# Altium project Buck Converter.PrjPcb
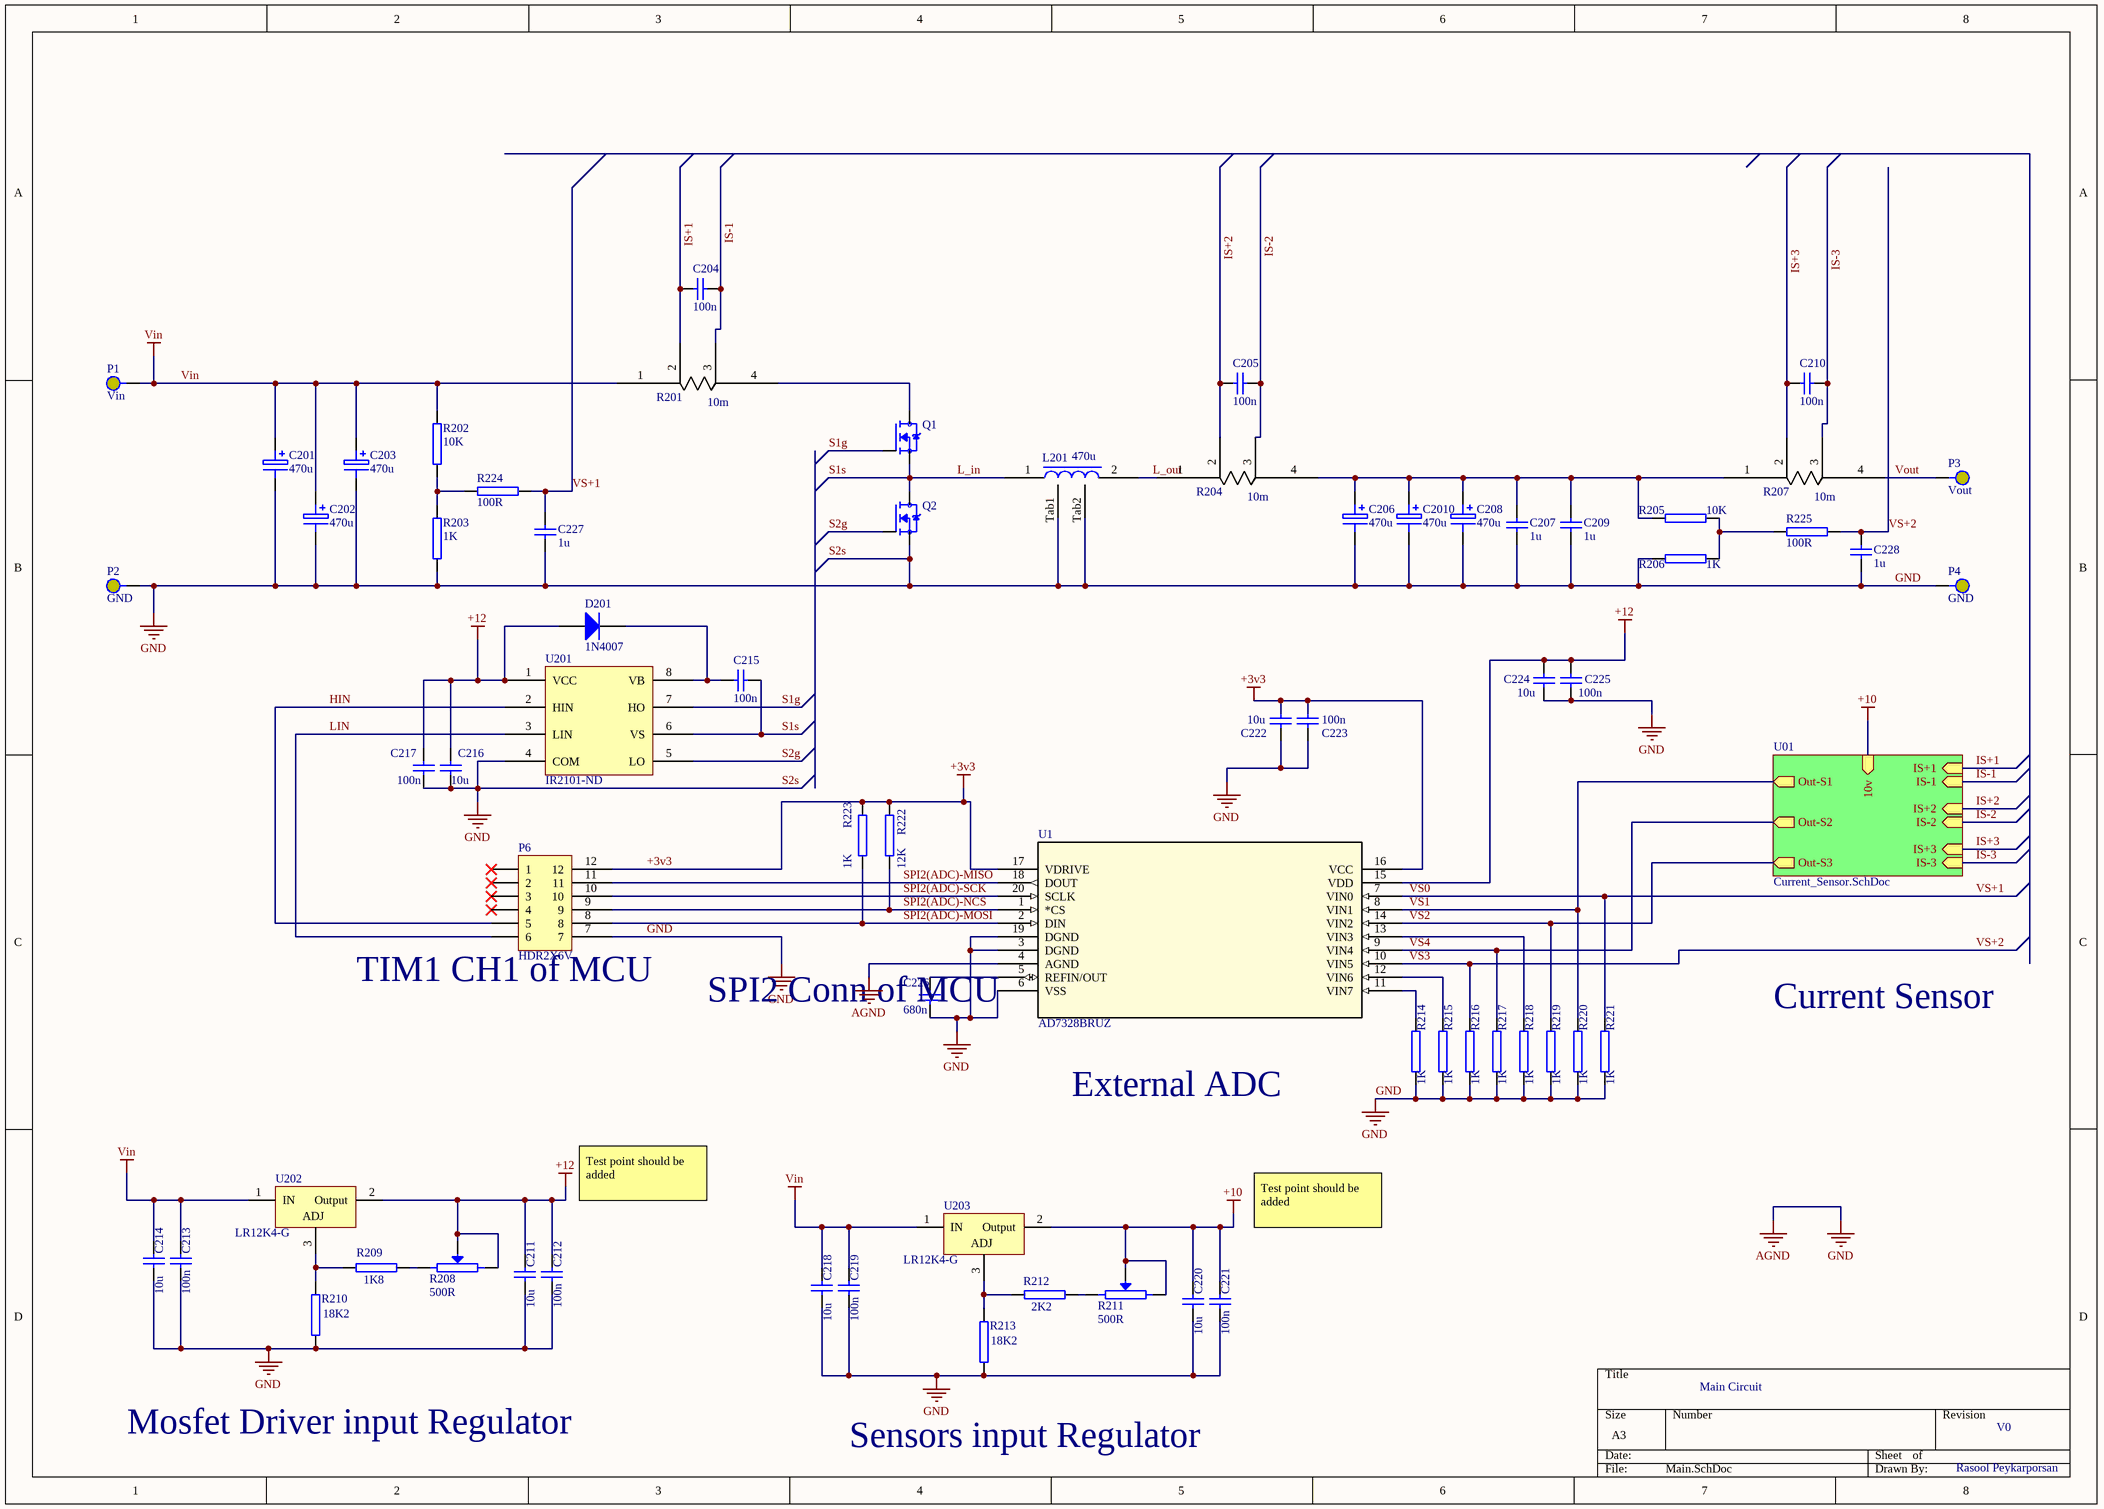
[diagram p0: Main.SchDoc]
2 sheets, 73 parts. Net scope: hierarchical (ports join the sheet entries above them; power ports are global).
Board file: PCB.PcbDoc
Sheets:
  Main.SchDoc
    U01 = Current_Sensor.SchDoc

## Sheet Main.SchDoc
size A3; SheetNumber: 1; SheetTotal: 2

### Parts
C201  470u  [CAPP200-400_AUT]
C202  470u  [CAPP200-400_AUT]
C203  470u  [CAPP200-400_AUT]
C204  100n  [CAP_1206]
C205  100n  [CAP_1206]
C206  470u  [CAPP200-400_AUT]
C207  1u  [RAD-0.2_AUT]
C208  470u  [CAPP200-400_AUT]
C209  1u  [RAD-0.2_AUT]
C210  100n  [CAP_1206]
C211  10u  [CAP_1206]
C212  100n  [CAP_1206]
C213  100n  [CAP_1206]
C214  10u  [CAP_1206]
C215  100n  [RAD-0.2_AUT]
C216  10u  [CAP_1206]
C217  100n  [CAP_1206]
C218  10u  [CAP_1206]
C219  100n  [CAP_1206]
C220  10u  [CAP_1206]
C221  100n  [CAP_1206]
C222  10u  [CAP_1206]
C223  100n  [CAP_1206]
C224  10u  [CAP_1206]
C225  100n  [CAP_1206]
C226  680n  [CAP_1206]
C227  1u  [CAP_1206]
C228  1u  [CAP_1206]
C2010  470u  [CAPP200-400_AUT]
D201  1N4007  [DIODE0.4_AUT]
L201  470u  [AGP4233_Hi]
P1  Vin  [Banana_AUT]
P2  GND  [Banana_AUT]
P3  Vout  [Banana_AUT]
P4  GND  [Banana_AUT]
P6  HDR2X6V  [HDR2X6V]
Q1  N-CHANNEL MOSFET,TOLL-8L  [TOLL-8L]  (value not drawn)
Q2  N-CHANNEL MOSFET,TOLL-8L  [TOLL-8L]  (value not drawn)
R201  10m  [WSL3673R_002-01]
R202  10K  [RES_1206]
R203  1K  [RES_1206]
R204  10m  [WSL3673R_002-01]
R205  10K  [RES_1206]
R206  1K  [RES_1206]
R207  10m  [WSL3673R_002-01]
R208  500R  [3296W]
R209  1K8  [RES_1206]
R210  18K2  [RES_1206]
R211  500R  [3296W]
R212  2K2  [RES_1206]
R213  18K2  [RES_1206]
R214  1K  [RES_1206]
R215  1K  [RES_1206]
R216  1K  [RES_1206]
R217  1K  [RES_1206]
R218  1K  [RES_1206]
R219  1K  [RES_1206]
R220  1K  [RES_1206]
R221  1K  [RES_1206]
R222  12K  [RES_1206]
R223  1K  [RES_1206]
R224  100R  [RES_1206]
R225  100R  [RES_1206]
U1  AD7328BRUZ  [TSSOP20_44]
U201  IR2101-ND  [DIP8-AUT]
U202  LR12K4-G  [D PAK (TO-252-3)]
U203  LR12K4-G  [D PAK (TO-252-3)]

### Sub-sheets
U01 = Current_Sensor.SchDoc: IS+1 (in), IS-1 (in), Out-S1 (out), IS+2 (in), IS-2 (in), Out-S2 (out), IS+3 (in), IS-3 (in), Out-S3 (out), 10v (in)

### Nets
+3v3: C222.2 C223.2 P6.12 R222.2 R223.2 U1.16(VCC) U1.17(VDRIVE)
+10: C220.2 C221.2 R211.2(BOT) R211.W(TAP) U203.2(Output) ; sheet U01/10v
+12: C211.2 C212.2 C216.2 C217.2 C224.2 C225.2 D201.A R208.2(BOT) R208.W(TAP) U1.15(VDD) U201.1(VCC) U202.2(Output)
GND: C201.2 C202.2 C203.2 C206.2 C207.1 C208.2 C209.1 C211.1 C212.1 C213.1 C214.1 C216.1 C217.1 C218.1 C219.1 C220.1 C221.1 C222.1 C223.1 C224.1 C225.1 C226.1 C227.1 C228.1 C2010.2 L201.Tab1 L201.Tab2 P2.1 P4.1 P6.7 Q2.2(S) R203.2 R206.1 R210.1 R213.1 R214.1 R215.1 R216.1 R217.1 R218.1 R219.1 R220.1 R221.1 U1.3(DGND) U1.4(AGND) U1.6(VSS) U1.19(DGND) U201.4(COM)  [also labelled AGND, S2s]
Vin: C201.1 C202.1 C203.1 C213.2 C214.2 C218.2 C219.2 P1.1 R201.1 R202.1 U202.1(IN) U203.1(IN)
HIN: P6.5 U201.2(HIN)
IS+1: C204.1 R201.2 ; sheet U01/IS+1
IS+2: C205.1 R204.2 ; sheet U01/IS+2
IS+3: C210.1 R207.2 ; sheet U01/IS+3
IS-1: C204.2 R201.3 ; sheet U01/IS-1
IS-2: C205.2 R204.3 ; sheet U01/IS-2
IS-3: C210.2 R207.3 ; sheet U01/IS-3
L_in: C215.2 L201.1 Q1.2(S) Q2.3(D) U201.6(VS)  [also labelled S1s]
L_out: L201.2 R204.1
LIN: P6.6 U201.3(LIN)
S1g: Q1.1(G) U201.7(HO)
S2g: Q2.1(G) U201.5(LO)
SPI2(ADC)-MISO: P6.11 U1.18(DOUT)
SPI2(ADC)-MOSI: P6.8 R223.1 U1.2(DIN)
SPI2(ADC)-NCS: P6.9 R222.1 U1.1(*CS)
SPI2(ADC)-SCK: P6.10 U1.20(SCLK)
Vout: P3.1 R207.4
VS1: R220.2 U1.8(VIN1) ; sheet U01/Out-S1
VS2: R219.2 U1.14(VIN2) ; sheet U01/Out-S3
VS4: R217.2 U1.9(VIN4) ; sheet U01/Out-S2
VS+1: C227.2 R221.2 R224.2 U1.7(VIN0)  [also labelled VS0]
VS+2: C228.2 R216.2 R225.2 U1.10(VIN5)  [also labelled VS3]
NetC206_1: C206.1 C207.2 C208.1 C209.2 C2010.1 R204.4 R205.1 R207.1
NetC215_1: C215.1 D201.K U201.8(VB)
NetC226_2: C226.2 U1.5(REFIN/OUT)
NetQ1_3: Q1.3(D) R201.4
NetR202_2: R202.2 R203.1 R224.1
NetR205_2: R205.2 R206.2 R225.1
NetR208_1: R208.1(TOP) R209.1
NetR209_2: R209.2 R210.2 U202.3(ADJ)
NetR211_1: R211.1(TOP) R212.1
NetR212_2: R212.2 R213.2 U203.3(ADJ)
NetR214_2: R214.2 U1.11(VIN7)
NetR215_2: R215.2 U1.12(VIN6)
NetR218_2: R218.2 U1.13(VIN3)

Not connected (* = marked no-connect by the designer): P6 1* 2* 3* 4*

### Notes on the sheet
- TIM1 CH1 of MCU
- (near P6) SPI2 Conn of MCU
- Current Sensor
- External ADC
- Test point should be added
- Main Circuit
- Mosfet Driver input Regulator
- Sensors input Regulator
- V0
- Rasool Peykarporsan

### Library data of the parts
C201-C203 C206 C208 C2010 = CAPP200-400: Polarized Aluminum Capacitor, Through Hole, Pitch 200mil, Body 400mil (Dia)
C204 C205 C210-C214 C216-C228 = CAPN 1206: Non Polarized Capacitor, SMD, 1206
C207 C209 C215 = CAPN RAD0.2: Non Polarized Capacitor, Multilayer Ceramic Dipped Radial, Pitch 200mil
D201 = 1N4007: Diode, Standard, 1A, 1000v; Supplier 1: Farnell; Supplier Part Number 1: 9549129
L201 = AGP4233Hi: Power Inductor / Through hole
P1-P4 = Banana Socket: Banana Socket, 4mm, Panel, Black, 10A; Supplier 1: Farnell; Supplier Part Number 1: 1101113
P6 = HDR2X6V: Header, 12-Pin, Dual row, 2.54mm Pitch, Straight
Q1 Q2 = MCTL80N20Y-TP: N-Channel 200 V 80A (Tc) 250W (Tj) Surface Mount TOLL-8L
R201 R204 R207 = WSL3673R-01: Current Shunt / Kelvin 4W 0.002- 0.01
R202 R203 R205 R206 R209 R210 R212-R225 = Resistor 1206: Resistor, SMD, 1206
R208 R211 = 3296W-1-104LF: 3296W Series, 3/8 ” Square Potentiometer, 100k, 10%,  0.5 Watts, Multi Turn / Part #: PV36W501C01B00; Supplier 1: Farnell; Supplier Part Number 1: 9353194
U1 = AD7328BRUZ: ADC 12 Bit / Package TSSOP20
U201 = IR2101-ND: Half-Bridge Gate Driver IC Non-Inverting 8-PDIP
U202 U203 = LR12K4-G: Adj Positive Regulator / Linear. 12V dropout V. / 2W

## Sheet Current_Sensor.SchDoc
size A4; SheetNumber: 4; SheetTotal: 5
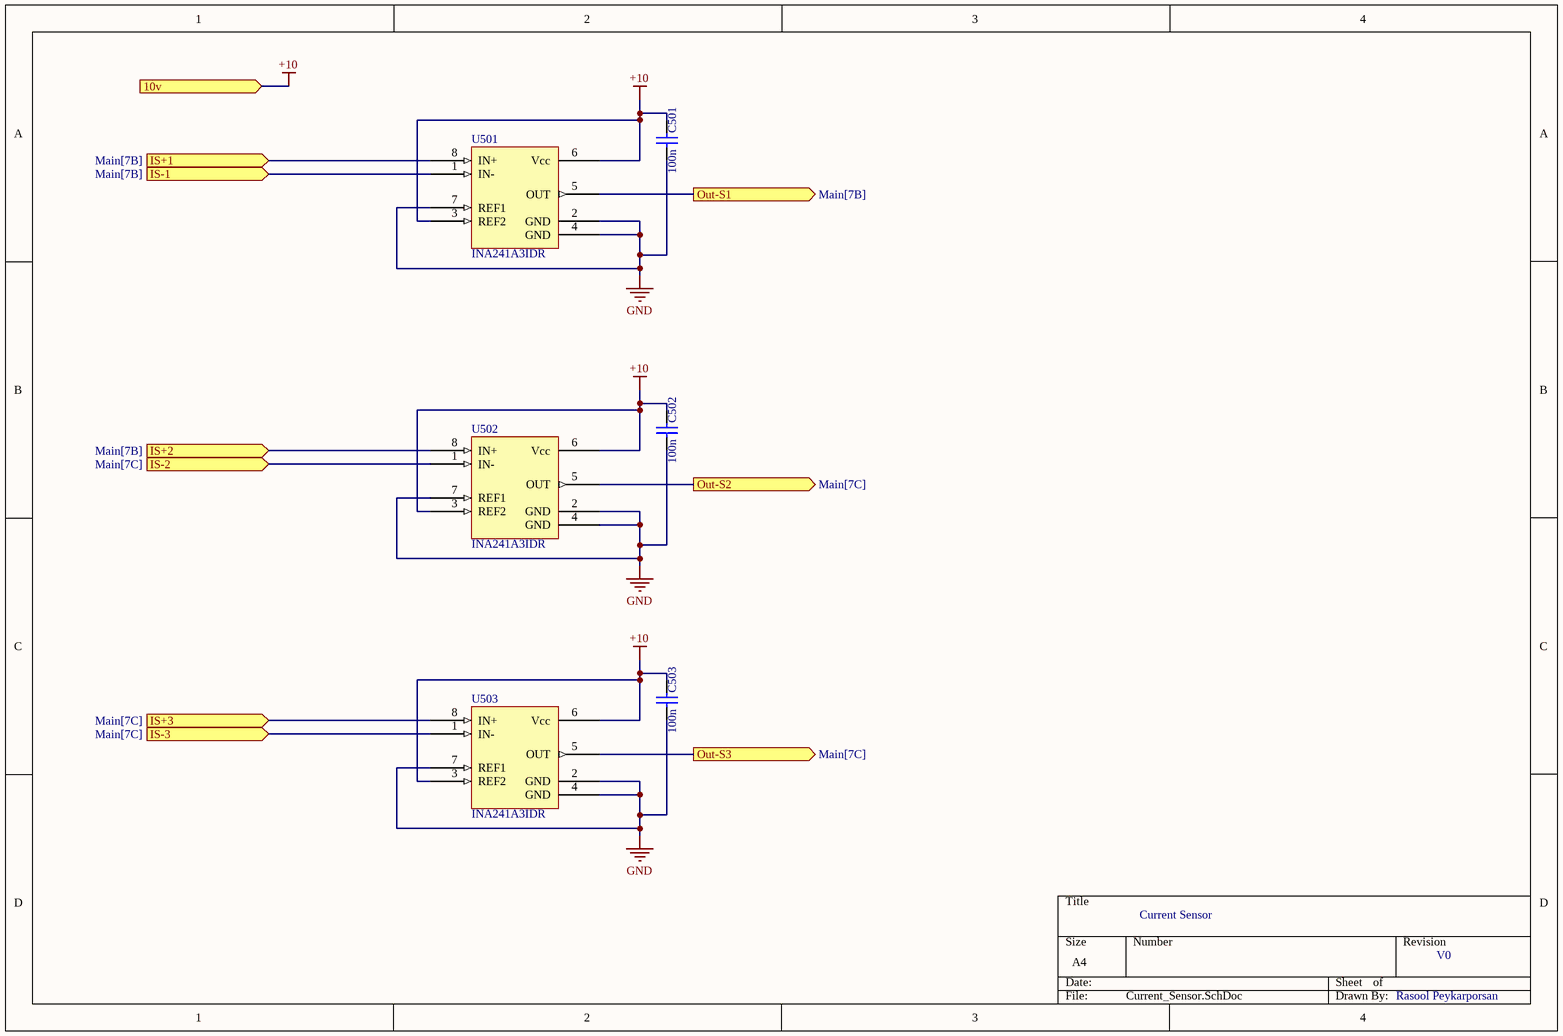
[diagram p1: Current_Sensor.SchDoc]

### Parts
C501  100n  [CAP_1206]
C502  100n  [CAP_1206]
C503  100n  [CAP_1206]
U501  INA241A3IDR  [8SOIC-M]
U502  INA241A3IDR  [8SOIC-M]
U503  INA241A3IDR  [8SOIC-M]

### Ports
10v (in), IS+1 (in, see Main[7B]), IS+2 (in, see Main[7B]), IS+3 (in, see Main[7C]), IS-1 (in, see Main[7B]), IS-2 (in, see Main[7C]), IS-3 (in, see Main[7C]), Out-S1 (out, see Main[7B]), Out-S2 (out, see Main[7C]), Out-S3 (out, see Main[7C])

### Nets
+10: C501.2 C502.2 C503.2 U501.3(REF2) U501.6(Vcc) U502.3(REF2) U502.6(Vcc) U503.3(REF2) U503.6(Vcc) ; port 10v
GND: C501.1 C502.1 C503.1 U501.2(GND) U501.4(GND) U501.7(REF1) U502.2(GND) U502.4(GND) U502.7(REF1) U503.2(GND) U503.4(GND) U503.7(REF1)
IS+1: U501.8(IN+) ; port IS+1
IS+2: U502.8(IN+) ; port IS+2
IS+3: U503.8(IN+) ; port IS+3
IS-1: U501.1(IN-) ; port IS-1
IS-2: U502.1(IN-) ; port IS-2
IS-3: U503.1(IN-) ; port IS-3
VS1: U501.5(OUT) ; port Out-S1
VS2: U503.5(OUT) ; port Out-S3
VS4: U502.5(OUT) ; port Out-S2

### Notes on the sheet
- Current Sensor
- V0
- Rasool Peykarporsan

### Library data of the parts
C501-C503 = CAPN 1206: Non Polarized Capacitor, SMD, 1206
U501-U503 = INA241A3IDR: Current Sense Amplifier 1 Circuit Single-Ended 8-SOIC

## Nets that join several sheets
+10: Main (5 pins), Current_Sensor (9 pins)
GND: Main (48 pins), Current_Sensor (12 pins)
IS+1: Main (C204.1 R201.2), Current_Sensor (U501.8)
IS+2: Main (C205.1 R204.2), Current_Sensor (U502.8)
IS+3: Main (C210.1 R207.2), Current_Sensor (U503.8)
IS-1: Main (C204.2 R201.3), Current_Sensor (U501.1)
IS-2: Main (C205.2 R204.3), Current_Sensor (U502.1)
IS-3: Main (C210.2 R207.3), Current_Sensor (U503.1)
VS1: Main (R220.2 U1.8), Current_Sensor (U501.5)
VS2: Main (R219.2 U1.14), Current_Sensor (U503.5)
VS4: Main (R217.2 U1.9), Current_Sensor (U502.5)